# EAGLE design M452A (EAGLE 6.6.0)
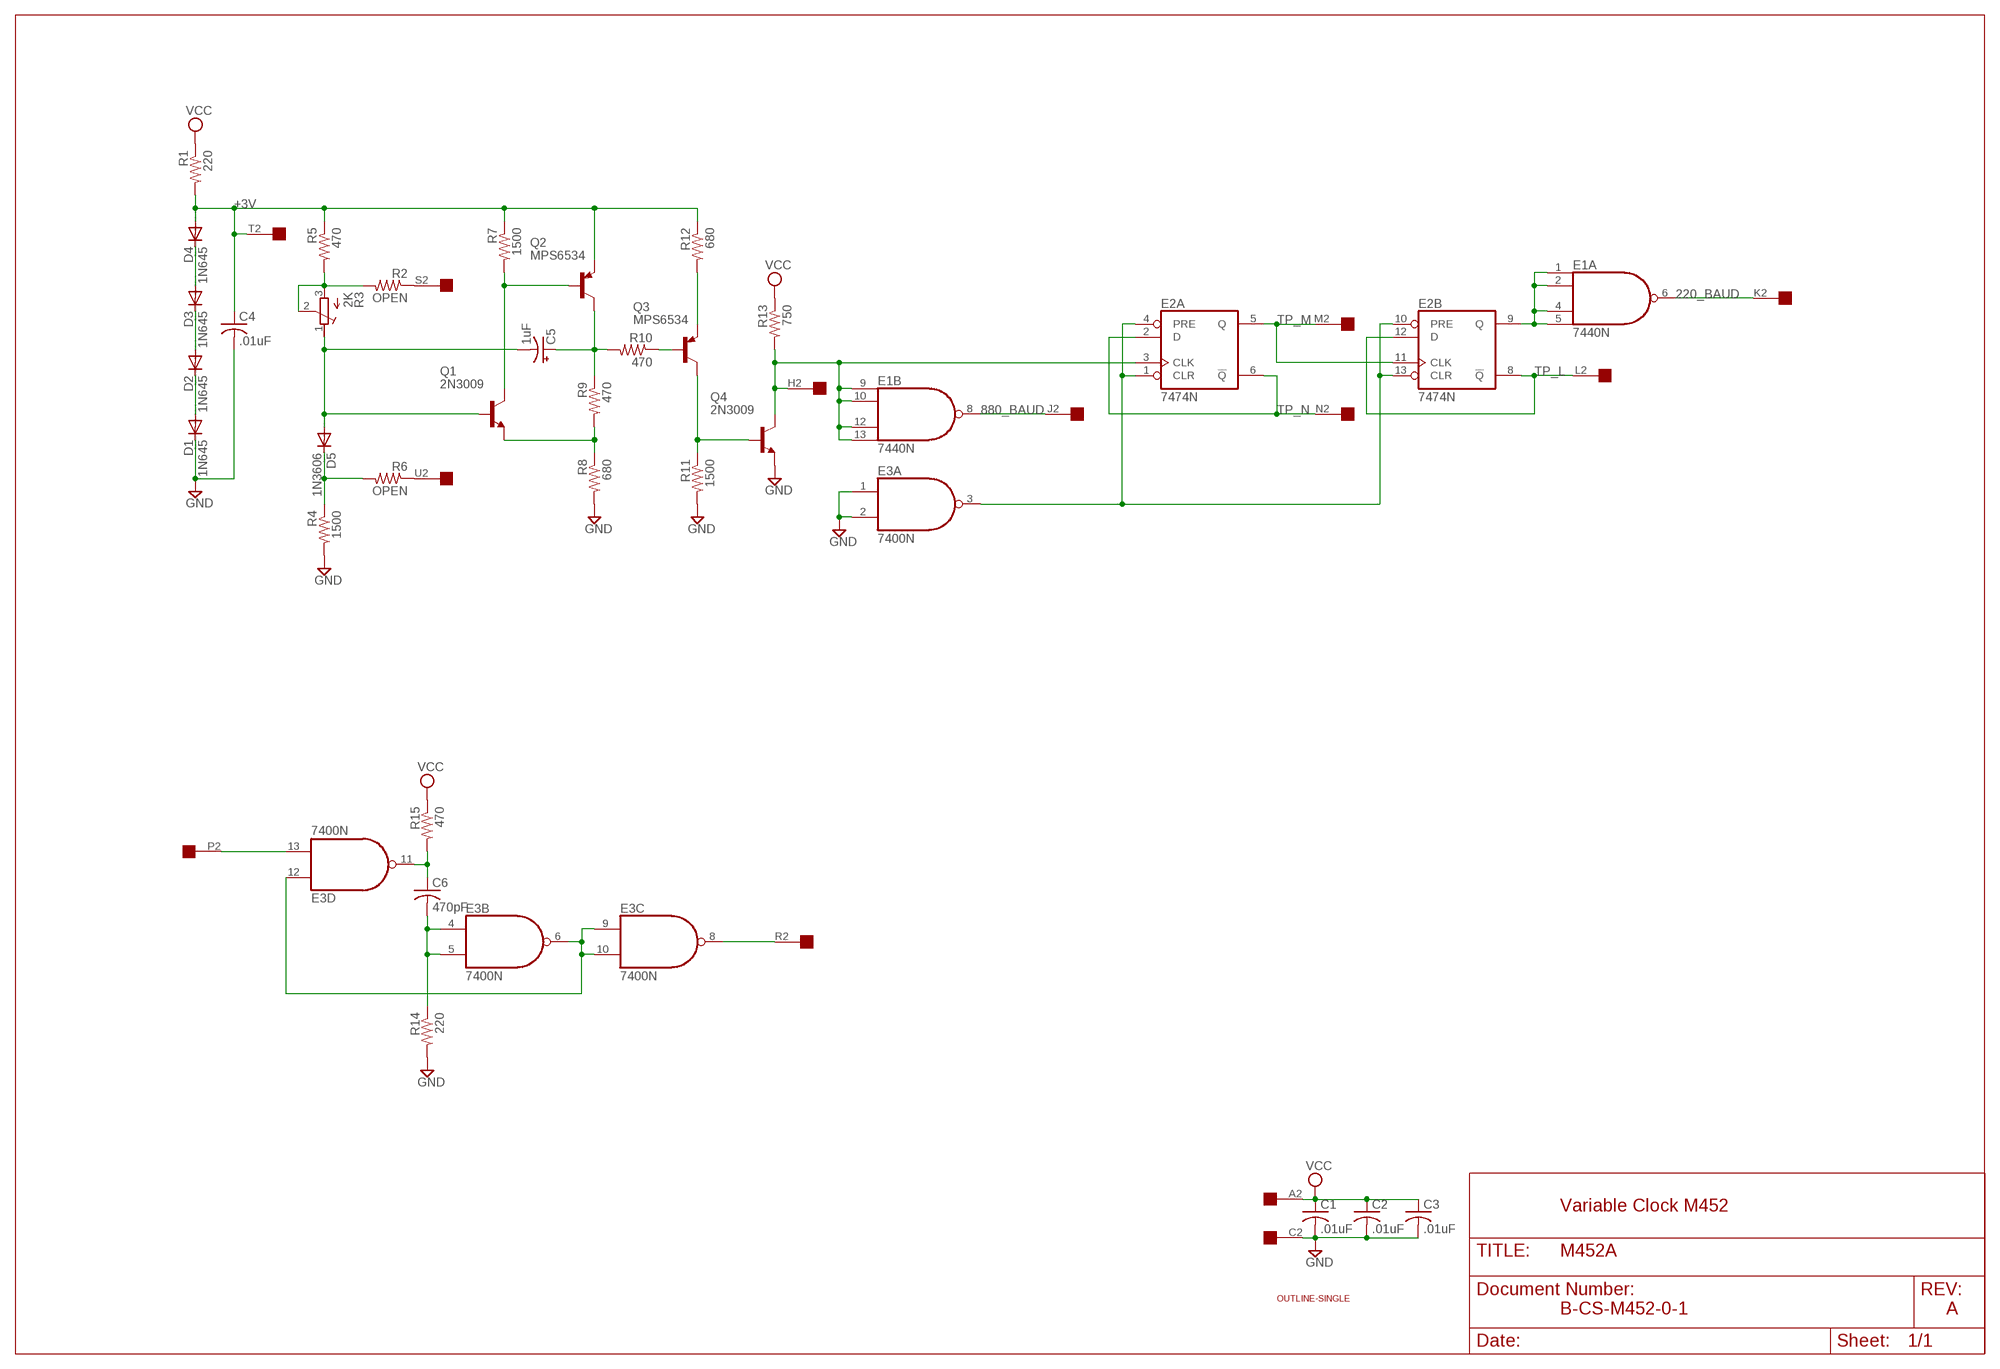
[diagram p0: schematic, sheet 1]

## Parts
C1  .01uF  C-US050-025X075  [C050-025X075]
C2  .01uF  C-US050-025X075  [C050-025X075]
C3  .01uF  C-US050-025X075  [C050-025X075]
C4  .01uF  C-US050-025X075  [C050-025X075]
C5  1uF  CPOL-USE15-5AXIAL  [E15-5]
C6  470pF  C-US150-054X183  [C150-054X183]
D1  1N645  1N4148DO35-10  [DO35-10]
D2  1N645  1N4148DO35-10  [DO35-10]
D3  1N645  1N4148DO35-10  [DO35-10]
D4  1N645  1N4148DO35-10  [DO35-10]
D5  1N3606  1N4148DO35-10  [DO35-10]
E1  7440N  74S20N  [DIL14]
E2  7474N  74S74N  [DIL14]
E3  7400N  [DIL14]
Q1  2N3009  2N3019-NPN-TO39-EBC  [TO39]
Q2  MPS6534  2N3637-PNP-TO39-EBC  [TO39]
Q3  MPS6534  2N3637-PNP-TO39-EBC  [TO39]
Q4  2N3009  2N3019-NPN-TO39-EBC  [TO39]
R1  220  R-US_0207/10  [0207/10]
R2  OPEN  R-US_0207/10  [0207/10]
R3  2K  275P  [3006Y]
R4  1500  R-US_0207/10  [0207/10]
R5  470  R-US_0207/10  [0207/10]
R6  OPEN  R-US_0207/10  [0207/10]
R7  1500  R-US_0207/10  [0207/10]
R8  680  R-US_0207/10  [0207/10]
R9  470  R-US_0207/10  [0207/10]
R10  470  R-US_0207/10  [0207/10]
R11  1500  R-US_0207/10  [0207/10]
R12  680  R-US_0207/10  [0207/10]
R13  750  R-US_0207/10  [0207/10]
R14  220  R-US_0207/10  [0207/10]
R15  470  R-US_0207/10  [0207/10]
U$1  OUTLINE-SINGLE  [SINGLE]
U$2  EDGE-1  [EDGE-CON1]

## Nets
220_BAUD: E1.6(A:O) U$2.K2
880_BAUD: E1.8(B:O) U$2.J2
+3V: C4.1 D4.A Q2.1(E) R1.2 R5.1 R7.1 R12.1 U$2.T2
GND [power]: C1.2 C2.2 C3.2 C4.2 D1.C E3.1(A:I0) E3.2(A:I1) Q4.1(E) R4.2 R8.2 R11.2 R14.2 U$2.C2
N$1: C5.+ Q2.3(C) R9.1 R10.2
N$2: C5.- D5.A Q1.2(B) R3.1(A)
N$3: Q1.1(E) R8.1 R9.2
N$4: E1.1(A:I0) E1.2(A:I1) E1.4(A:I2) E1.5(A:I3) E2.9(B:Q)
N$5: Q1.3(C) Q2.2(B) R7.2
N$6: R2.2 R3.2(S) R3.3(E) R5.2
N$7: D5.C R4.1 R6.2
N$8: Q3.2(B) R10.1
N$9: Q3.1(E) R12.2
N$10: Q3.3(C) Q4.2(B) R11.1
N$11: E2.1(A:CLR) E2.4(A:PRE) E2.10(B:PRE) E2.13(B:CLR) E3.3(A:O)
N$12: E3.13(D:I1) U$2.P2
N$13: E1.9(B:I0) E1.10(B:I1) E1.12(B:I2) E1.13(B:I3) E2.3(A:CLK) Q4.3(C) R13.2 U$2.H2
N$14: C6.2 E3.4(B:I0) E3.5(B:I1) R14.1
N$15: D3.A D4.C
N$16: C6.1 E3.11(D:O) R15.2
N$17: E3.6(B:O) E3.9(C:I0) E3.10(C:I1) E3.12(D:I0)
N$18: D2.A D3.C
N$19: D1.A D2.C
N$21: E3.8(C:O) U$2.R2
N$22: R6.1 U$2.U2
N$23: R2.1 U$2.S2
TP_L: E2.8(B:!Q) E2.12(B:D) U$2.L2
TP_M: E2.5(A:Q) E2.11(B:CLK) U$2.M2
TP_N: E2.2(A:D) E2.6(A:!Q) U$2.N2
VCC [power]: C1.1 C2.1 C3.1 R1.1 R13.1 R15.1 U$2.A2
Unconnected: U$2.B2 U$2.D2 U$2.E2 U$2.F2 U$2.V2

## Notes on the sheet
- Variable Clock M452
- B-CS-M452-0-1 | A

## Power pins joined to a net without a drawn wire
GND: E1.7(P:GND) E2.7(P:GND) E3.7(P:GND)
VCC: E1.14(P:VCC) E2.14(P:VCC) E3.14(P:VCC)

## Library data of the parts
C1-C4 C6 = rcl:C-US: CAPACITOR, American symbol
C5 = rcl:CPOL-US: POLARIZED CAPACITOR, American symbol
D1-D5 = diode:1N4148: DIODE high speed (Philips)
E1 = 74xx-us:74*20: Dual 4-input NAND gate
E2 = 74xx-us:74*74: Dual D type positive edge triggered FLIP FLOP, preset and clear
E3 = 74xx-us:74*00: Quad 2-input NAND gate
Q1 Q4 = transistor:*-NPN-: NPN Transistror BF959 corrected 2008.03.06
Q2 Q3 = transistor:*-PNP-: PNP Transistror
R1 R2 R4-R15 = rcl:R-US_: RESISTOR, American symbol
R3 = dec-con:275P: Trimpot with 275P (3006Y) footprint.
U$1 = dec-con:OUTLINE-*: Board outlines for DEC boards.
U$2 = dec-con:EDGE-1: Single-Sided DEC Edge Connector -- (side 2)

## Net classes
1 power: width 0.813 mm

## Board
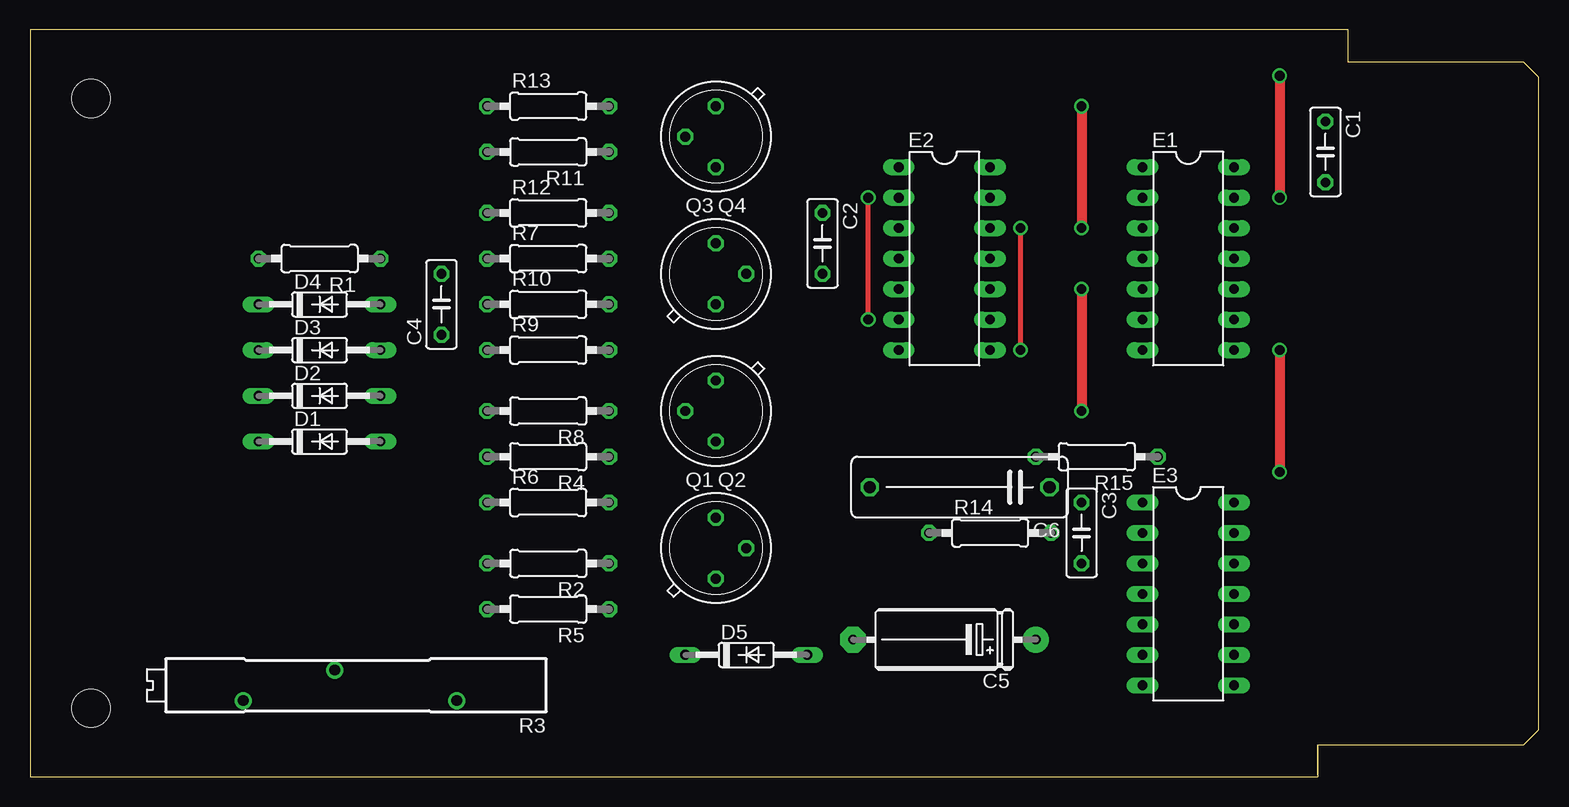
[diagram p1: board, top side]
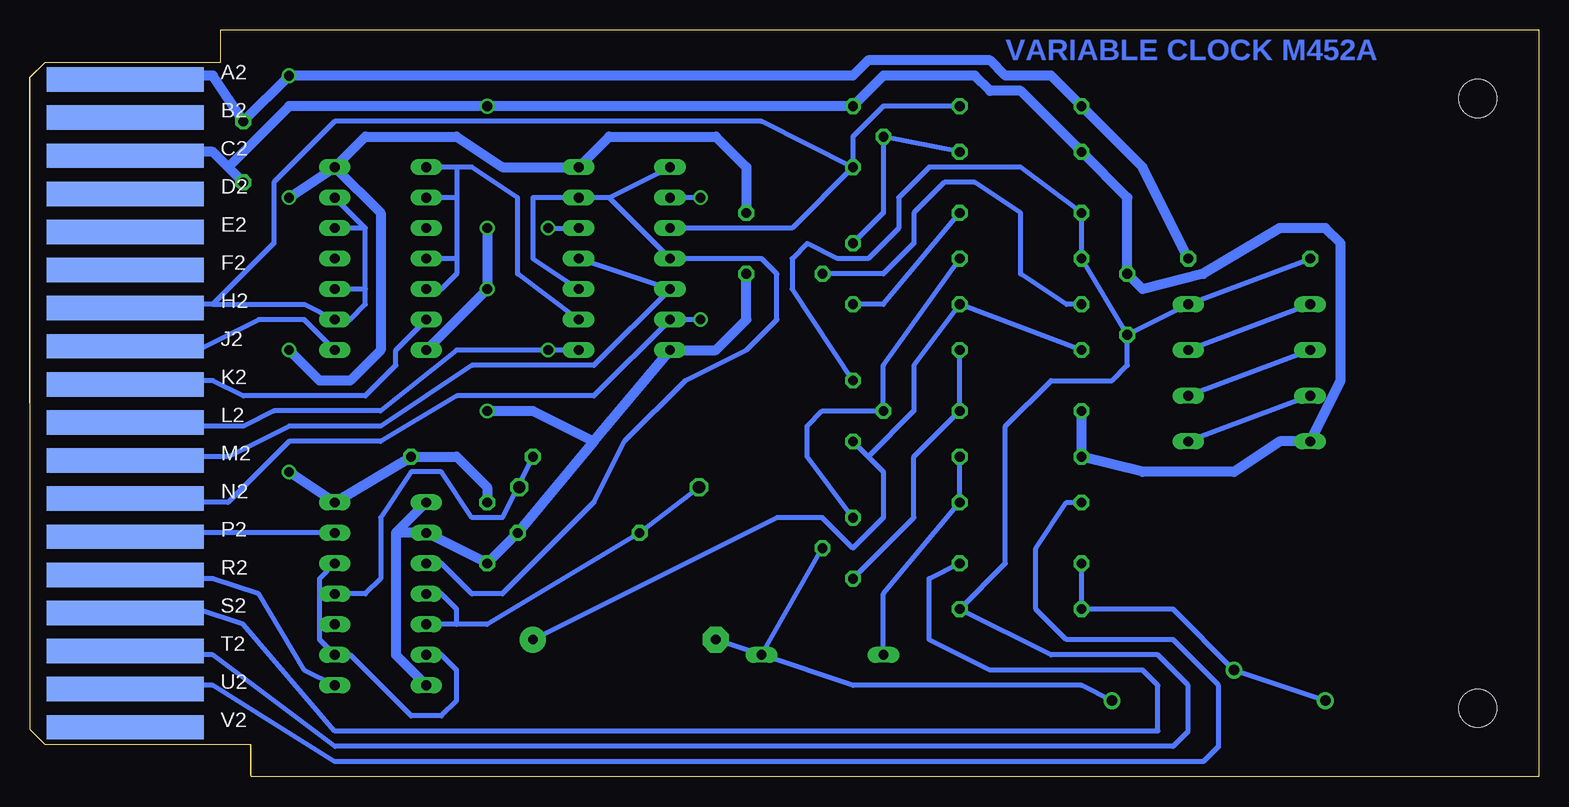
[diagram p2: board, bottom side, seen from below]

Size 125.73 x 62.23 mm. Coordinates in mm from the lower left corner, seen from the top.
Copper layers (1+16): Top 0.035mm / dielectric 1.5mm / Bottom 0.035mm
Design rules "16mils": minimum track width 16mil, minimum drill 32mil, track to track 15mil, track to pad 10mil, pad to pad 10mil, via to via 10mil, smd to smd 10mil, copper to edge 13mil, drill to drill 10mil, minimum pad ring 10mil, minimum via ring 8mil, stop-mask expansion 0mil, vias tented up to drill 0mil, thermal gap 10mil

### Footprints (pad centres in the part's own frame; a part is rotated, then mirrored left to right if it is on the bottom)
C050-025X075 = drill 0.813 octagon: 1 -2.54,0; 2 2.54,0
E15-5 = drill 0.813 pad 2.159: + -7.62,0 | drill 0.813 pad 2.159 octagon: - 7.62,0
C150-054X183 = drill 1.016 octagon: 1 -7.493,0; 2 7.493,0
DO35-10 = drill 0.813 long: A 5.08,0; C -5.08,0
DIL14 = drill 0.813 long: 1 -7.62,-3.81; 2 -5.08,-3.81; 3 -2.54,-3.81; 4 0,-3.81; 5 2.54,-3.81; 6 5.08,-3.81; 7 7.62,-3.81; 8 7.62,3.81; 9 5.08,3.81; 10 2.54,3.81; 11 0,3.81; 12 -2.54,3.81; 13 -5.08,3.81; 14 -7.62,3.81
TO39 = drill 0.813 octagon: 1 0,-2.54; 2 2.54,0; 3 0,2.54
0207/10 = drill 0.813 octagon: 1 -5.08,0; 2 5.08,0
3006Y = drill 0.9: 1 -8.89,1.27; 2 1.27,-1.27; 3 8.89,1.27
SINGLE = hole 3.175: 120.65,56.515; 120.65,5.715
EDGE-CON1 = smd 13.106 x 2.032 bottom: A2 7.938,4.128; B2 7.938,7.303; C2 7.938,10.477; D2 7.938,13.652; E2 7.938,16.828; F2 7.938,20.003; H2 7.938,23.177; J2 7.938,26.352; K2 7.938,29.527; L2 7.938,32.703; M2 7.938,35.877; N2 7.938,39.053; P2 7.938,42.227; R2 7.938,45.403; S2 7.938,48.578; T2 7.938,51.752; U2 7.938,54.928; V2 7.938,58.102

### Placement (x,y rotation side)
C1  107.95,52.07 270 top
C2  66.04,44.45 270 top
C3  87.63,20.32 270 top
C4  34.29,39.37 90 top
C5  76.2,11.43 180 top
C6  77.47,24.13 180 top
D1  24.13,27.94 0 top
D2  24.13,31.75 0 top
D3  24.13,35.56 0 top
D4  24.13,39.37 0 top
D5  59.69,10.16 0 top
E1  96.52,43.18 270 top
E2  76.2,43.18 270 top
E3  96.52,15.24 270 top
Q1  57.15,19.05 0 top
Q2  57.15,30.48 180 top
Q3  57.15,41.91 0 top
Q4  57.15,53.34 180 top
R1  24.13,43.18 180 top
R2  43.18,17.78 180 top
R3  26.67,7.62 180 top
R4  43.18,26.67 180 top
R5  43.18,13.97 180 top
R6  43.18,22.86 0 top
R7  43.18,43.18 0 top
R8  43.18,30.48 180 top
R9  43.18,35.56 0 top
R10  43.18,39.37 0 top
R11  43.18,52.07 180 top
R12  43.18,46.99 0 top
R13  43.18,55.88 0 top
R14  80.01,20.32 0 top
R15  88.9,26.67 180 top
U$1  125.73,62.23 180 top
U$2  125.73,62.23 180 top

### Tracks (layer width: path | path; a pad name or v marks a point on that pad's centre or on a via)
220_BAUD
  Bottom 0.406: U$2.K2 116.84,33.02 110.49,33.02 107.95,31.75 97.79,31.75 95.25,34.29 95.25,35.56 E1.6
880_BAUD
  Bottom 0.406: U$2.J2 116.84,35.56 111.76,35.56 106.68,38.1 102.87,38.1 E1.8
+3V
  Bottom 0.406: R1.2 D4.A C4.1 | C4.1 R7.1 R12.1 43.18,50.8 50.8,50.8 53.34,48.26 53.34,45.72 55.88,43.18 58.42,43.18 60.96,44.45 62.23,43.18 62.23,40.64 Q2.1 | U$2.T2 116.84,10.16 110.49,10.16 100.33,2.54 30.48,2.54 29.21,3.81 29.21,7.62 31.75,10.16 40.64,10.16 R5.1 44.45,17.78 44.45,29.21 40.64,33.02 35.56,33.02 34.29,34.29 C4.1
GND  (via drill 0.81)
  Top 0.813: v87.63,55.88 v87.63,45.72 | v87.63,40.64 v87.63,30.48
  Bottom 0.813: R8.2 R4.2 33.02,25.4 25.4,25.4 21.59,27.94 D1.C 16.51,33.02 16.51,44.45 17.78,45.72 21.59,45.72 27.94,41.91 33.02,40.64 C4.2 34.29,48.26 R11.2 43.18,57.15 45.72,57.15 46.99,58.42 54.61,58.42 Q4.1 v87.63,55.88 104.14,55.88 109.22,50.8 | U$2.C2 116.84,52.07 110.49,52.07 109.22,50.8 | 109.22,50.8 C1.2 | E3.7 95.25,10.16 95.25,20.32 | 95.25,20.32 E3.2 C3.2 R14.2 78.74,27.94 | 95.25,20.32 E3.1 | 78.74,27.94 E2.7 68.58,35.56 66.04,38.1 C2.2 | v87.63,45.72 v87.63,40.64 E1.7 | v87.63,30.48 83.82,30.48 78.74,27.94
N$1
  Bottom 0.406: 55.88,26.67 54.61,25.4 54.61,21.59 57.15,19.05 59.69,21.59 63.5,21.59 C5.+ | 55.88,26.67 Q2.3 | 55.88,26.67 52.07,30.48 52.07,34.29 R10.2 R9.1
N$2
  Bottom 0.406: R3.1 38.1,7.62 57.15,7.62 D5.A | D5.A Q1.2 | D5.A C5.-
N$3
  Bottom 0.406: R9.2 R8.1 52.07,26.67 52.07,21.59 Q1.1
N$4
  Bottom 0.406: E1.5 91.44,40.64 90.17,41.91 90.17,43.18 | 90.17,48.26 90.17,43.18 | 90.17,50.8 90.17,48.26 | 90.17,50.8 E1.1 | 90.17,48.26 E1.2 | 90.17,43.18 E1.4 | E2.9 85.09,41.91 85.09,48.26 88.9,50.8 90.17,50.8
N$5
  Bottom 0.406: Q1.3 60.96,26.67 60.96,29.21 59.69,30.48 Q2.2 54.61,34.29 R7.2
N$6
  Bottom 0.406: R3.3 R3.2 30.48,13.97 R5.2 R2.2
N$7
  Bottom 0.406: R4.1 R6.2 54.61,15.24 D5.C
N$8
  Bottom 0.406: Q3.2 54.61,41.91 52.07,44.45 52.07,46.99 49.53,49.53 46.99,49.53 43.18,46.99 43.18,41.91 39.37,39.37 R10.1
N$9
  Bottom 0.406: R12.2 54.61,39.37 Q3.1
N$10
  Bottom 0.406: R11.1 Q4.2 54.61,46.99 Q3.3
N$11
  Bottom 0.406: E2.10 83.82,43.18 83.82,48.26 E2.13 77.47,48.26 | 77.47,48.26 E2.4 64.77,43.18 63.5,41.91 63.5,38.1 66.04,35.56 71.12,33.02 76.2,27.94 78.74,22.86 86.36,15.24 88.9,15.24 91.44,17.78 E3.3 | 77.47,48.26 E2.1
N$12
  Bottom 0.406: U$2.P2 116.84,20.32 E3.13
N$13
  Bottom 0.406: 97.79,45.72 E1.13 | 97.79,45.72 E1.12 | 97.79,40.64 97.79,39.37 99.06,38.1 E1.9 102.87,39.37 110.49,39.37 | 97.79,40.64 97.79,45.72 | 97.79,40.64 E1.10 | R13.2 54.61,55.88 57.15,53.34 Q4.3 | U$2.H2 116.84,39.37 110.49,39.37 | E2.3 62.23,45.72 Q4.3 | Q4.3 64.77,54.61 100.33,54.61 105.41,49.53 105.41,44.45 110.49,39.37
N$14
  Bottom 0.406: C6.2 R14.1 87.63,12.7 90.17,12.7 | 90.17,12.7 E3.5 | E3.4 91.44,15.24 90.17,13.97 90.17,12.7
N$15
  Bottom 0.406: D4.C D3.A
N$16
  Bottom 0.406: C6.1 85.09,24.13 | 85.09,24.13 R15.2 | 85.09,24.13 86.36,21.59 88.9,21.59 91.44,25.4 93.98,25.4 96.52,21.59 96.52,16.51 97.79,15.24 E3.11
N$17
  Bottom 0.406: 101.6,12.7 101.6,11.43 E3.9 99.06,10.16 93.98,5.08 91.44,5.08 90.17,6.35 90.17,8.89 91.44,10.16 E3.6 | 101.6,12.7 E3.10 | E3.12 101.6,16.51 101.6,12.7
N$18
  Bottom 0.406: D3.C D2.A
N$19
  Bottom 0.406: D2.C D1.A
N$21
  Bottom 0.406: U$2.R2 116.84,16.51 110.49,16.51 106.68,15.24 102.87,8.89 E3.8
N$22
  Bottom 0.406: U$2.U2 115.57,7.62 110.49,7.62 100.33,1.27 27.94,1.27 26.67,2.54 26.67,7.62 30.48,11.43 39.37,11.43 41.91,13.97 41.91,19.05 39.37,22.86 R6.1
N$23
  Bottom 0.406: U$2.S2 116.84,13.97 111.76,13.97 107.95,12.7 100.33,3.81 31.75,3.81 31.75,7.62 33.02,8.89 45.72,8.89 50.8,11.43 50.8,16.51 R2.1
TP_L  (via drill 0.81)
  Top 0.406: v82.55,35.56 v82.55,45.72
  Bottom 0.406: v82.55,45.72 E2.12 | E2.8 v82.55,35.56 90.17,35.56 96.52,30.48 105.41,30.48 107.95,29.21 116.84,29.21 U$2.L2
TP_M
  Bottom 0.406: E2.11 E2.5 78.74,34.29 88.9,34.29 96.52,29.21 104.14,29.21 109.22,26.67 116.84,26.67 U$2.M2
TP_N  (via drill 0.81)
  Top 0.406: v69.85,38.1 v69.85,48.26
  Bottom 0.406: v69.85,48.26 E2.2 | v69.85,38.1 E2.6 78.74,31.75 90.17,31.75 96.52,27.94 104.14,27.94 109.22,22.86 116.84,22.86 U$2.N2
VCC  (via drill 0.81)
  Top 0.813: v104.14,58.42 v104.14,48.26 | v104.14,35.56 v104.14,25.4
  Bottom 0.813: U$2.A2 116.84,58.42 110.49,58.42 C1.1 v104.14,58.42 57.15,58.42 55.88,59.69 45.72,59.69 44.45,58.42 40.64,58.42 R13.1 33.02,50.8 R1.1 | v104.14,48.26 E1.14 | E1.14 96.52,46.99 96.52,35.56 99.06,33.02 101.6,33.02 v104.14,35.56 | v104.14,25.4 E3.14 R15.1 90.17,26.67 87.63,24.13 C3.1 | C2.1 66.04,50.8 68.58,53.34 77.47,53.34 E2.14 86.36,50.8 90.17,53.34 97.79,53.34 E1.14

### Text on the board
Bottom: VARIABLE CLOCK M452A